# EAGLE design SENSE (EAGLE 9.6.2)
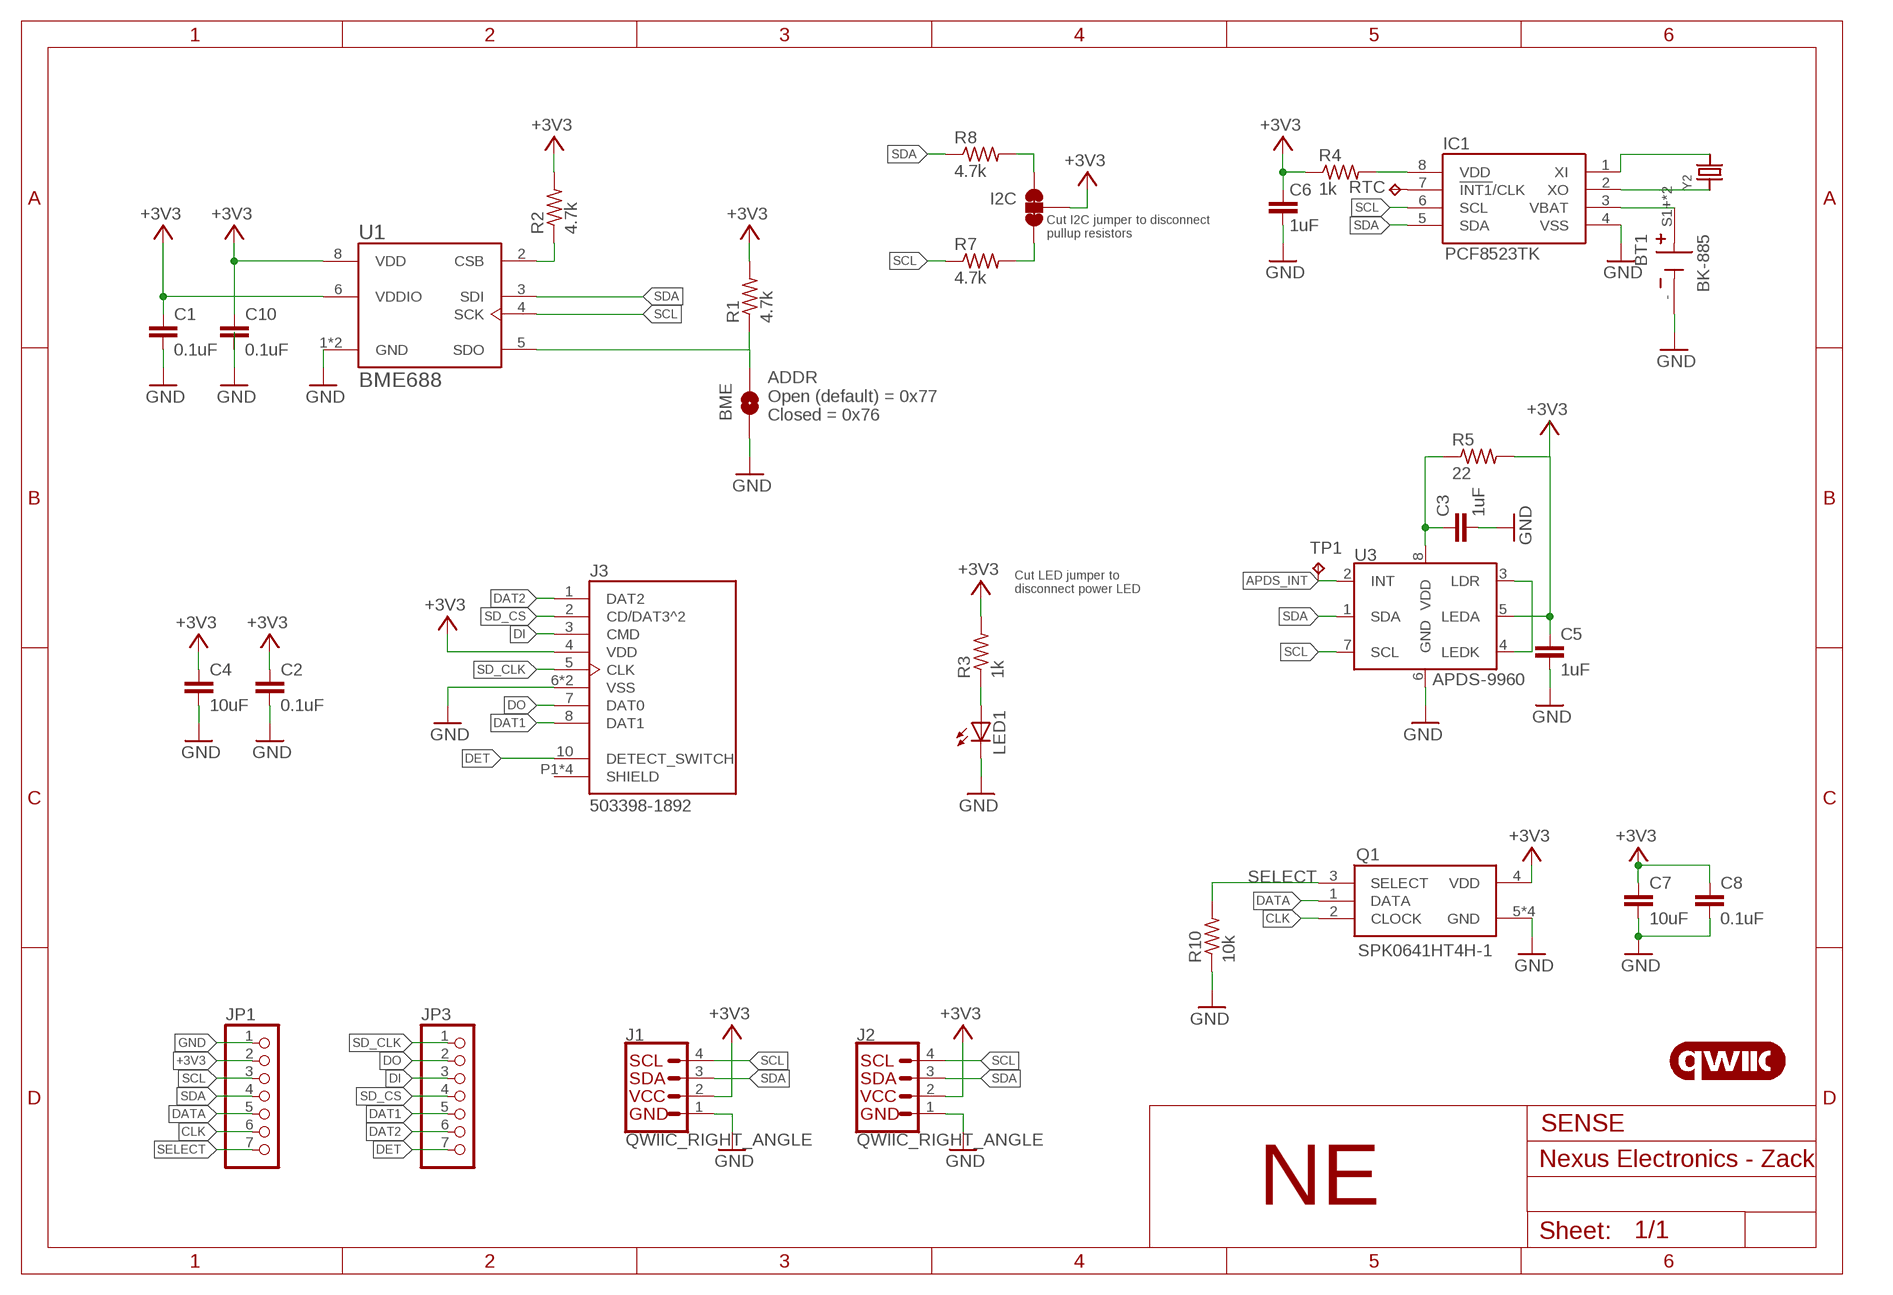
[diagram p0: schematic, sheet 1]

## Parts
BME  JUMPER-SMT_2_NO_SILK  [SMT-JUMPER_2_NO_SILK]
BT1  BK-885  [BAT_BK-885]
C1  0.1uF  C-0603  [0603-1608X90N]
C2  0.1uF  C-0603  [0603-1608X90N]
C3  1uF  C-0603  [0603-1608X90N]
C4  10uF  C-0603  [0603-1608X90N]
C5  1uF  C-0603  [0603-1608X90N]
C6  1uF  C-0603  [0603-1608X90N]
C7  10uF  C-0603  [0603-1608X90N]
C8  0.1uF  C-0603  [0603-1608X90N]
C10  0.1uF  C-0603  [0603-1608X90N]
I2C  JUMPER-SMT_3_2-NC_TRACE_SILK  [SMT-JUMPER_3_2-NC_TRACE_SILK]
IC1  PCF8523TK  PCF8523TK_1,118  [SON80P400X400X100-9N]
J1  QWIIC_RIGHT_ANGLE  QWIIC_CONNECTORJS-1MM  [JST04_1MM_RA]
J2  QWIIC_RIGHT_ANGLE  QWIIC_CONNECTORJS-1MM  [JST04_1MM_RA]
J3  503398-1892  [MOLEX_503398-1892]
JP1  MICROBUILDER_HEADER-1X12  [MICROBUILDER_1X12_ROUND]
JP3  MICROBUILDER_HEADER-1X12  [MICROBUILDER_1X12_ROUND]
LED1  LED_GREENCHIP-LED0603  [ADAFRUIT_CHIP-LED0603]
LOGO1  QWIIC_LOGO_CONNECTOR  [QWIIC_5.5MM]
Q1  SPK0641HT4H-1  [SPK0641HT4H1]
R1  4.7k  RCL_R-US_R0603  [0603-1608X90N]
R2  4.7k  RCL_R-US_R0603  [0603-1608X90N]
R3  1k  RCL_R-US_R0603  [0603-1608X90N]
R4  1k  RCL_R-US_R0603  [0603-1608X90N]
R5  22  RCL_R-US_R0603  [0603-1608X90N]
R7  4.7k  RCL_R-US_R0603  [0603-1608X90N]
R8  4.7k  RCL_R-US_R0603  [0603-1608X90N]
R10  10k  RCL_R-US_R0603  [0603-1608X90N]
RTC  TPB2,54  [B2,54]
TP1  TPB2,54  [B2,54]
U1  BME688  BME680  [PSON80P300X300X100-8N]
U3  APDS-9960  [APDS-9960]
Y2  MICROBUILDER_CRYSTAL_3215  [MICROBUILDER_XTAL3215]

## Nets
+3V3: C1.1 C2.1 C4.1 C5.1 C6.1 C7.1 C8.1 C10.1 I2C.2 J1.2 J2.2 J3.4(VDD) JP1.2 Q1.4(VDD) R1.2 R2.2 R3.2 R4.1 R5.2 U1.6(VDDIO) U1.8(VDD) U3.5(LEDA)
APDS_INT: TP1.TP U3.2(INT)
CLK: JP1.6 Q1.2(CLOCK)
CS: R2.1 U1.2(CSB)
DAT1: J3.8(DAT1) JP3.5
DAT2: J3.1(DAT2) JP3.6
DATA: JP1.5 Q1.1(DATA)
DET: J3.10(DETECT_SWITCH) JP3.7
DI: J3.3(CMD) JP3.3
DO: J3.7(DAT0) JP3.2
GND: BME.1 BT1.- C1.2 C2.2 C3.2 C4.2 C5.2 C6.2 C7.2 C8.2 C10.2 IC1.4(VSS) J1.1 J2.1 J3.6(VSS) J3.9(VSS) JP1.1 LED1.C Q1.5(GND) Q1.6(GND) Q1.7(GND) Q1.8(GND) R10.1 U1.1(GND) U1.7(GND) U3.6(GND)
N$1: C3.1 R5.1 U3.8(VDD)
N$2: IC1.2(XO) Y2.P$1
N$3: BT1.S1+(+) BT1.S2+(+) IC1.3(VBAT)
N$4: IC1.1(XI) Y2.P$2
N$5: LED1.A R3.1
N$6: IC1.7(!INT1!/CLK) RTC.TP
N$7: IC1.8(VDD) R4.2
N$8: I2C.1 R8.2
N$9: I2C.3 R7.2
N$10: U3.3(LDR) U3.4(LEDK)
SCL: IC1.6(SCL) J1.4 J2.4 JP1.3 R7.1 U1.4(SCK) U3.7(SCL)
SD_CLK: J3.5(CLK) JP3.1
SD_CS: J3.2(CD/DAT3^2) JP3.4
SDA: IC1.5(SDA) J1.3 J2.3 JP1.4 R8.1 U1.3(SDI) U3.1(SDA)
SDO/ADR: BME.2 R1.1 U1.5(SDO)
SELECT: JP1.7 Q1.3(SELECT) R10.2
Unconnected: J3.P1(SHIELD) J3.P2(SHIELD) J3.P3(SHIELD) J3.P4(SHIELD)

## Notes on the sheet
- Cut I2C jumper to disconnect
  pullup resistors
- ADDR
  Open (default) = 0x77
  Closed = 0x76
- Cut LED jumper to 
  disconnect power LED
- Nexus Electronics - Zack
- NE

## Library data of the parts
BME = SparkFun-Jumpers:JUMPER-SMT_2_NO: Normally open jumper This jumper has two pads in close proximity to each other. Apply solder to close the connection. Round pads are easier to solder for beginners, but are a lot larger. SparkFun Product that uses the round pads: SparkFun EL Sequencer <https://www.sparkfun.com/products/12781>
BT1 = BK-885:BK-885: BATTERY RETAINER COIN 12MM SMD Check availability <https://pricing.snapeda.com/parts/BK-885/MPD/view-part?ref=eda>; AVAILABILITY: In Stock; DESCRIPTION: BATTERY RETAINER COIN 12MM SMD; MF: MPD; MP: BK-885; PACKAGE: None; PRICE: None; PURCHASE-URL: https://pricing.snapeda.com/search/part/BK-885/?ref=eda
C1-C8 C10 = Arduino-rcl:C: SMD Capacitor
I2C = SparkFun-Jumpers:JUMPER-SMT_3_2-NC_TRACE: Normally closed trace jumper (2 of 2 connections) This jumper has a trace between all three pads so they are normally closed (NC). Use a razor knife to open the connection(s). For best results follow the IPC guidelines for cutting traces: Cutout at least 0.063 mm (0.005 in). Remove all loose material to clean up the cut area. Seal the cut with an approved epoxy. Reapply solder to reclose the connection(s).
IC1 = PCF8523:PCF8523TK_1,118: Real Time Clock Serial Clock/Calendar/Alarm/Timer/Battery Backup 8-Pin HVSON EP T/R Source: Datasheet <http://www.nxp.com/docs/en/data-sheet/PCF8523.pdf>; ARROW_PART_NUMBER: PCF8523TK/1,118; ARROW_PRICE-STOCK: https://www.arrow.com/en/products/pcf8523tk1118/nxp-semiconductors?region=nac; DESCRIPTION: Real Time Clock Serial Clock/Calendar/Alarm/Timer/Battery Backup 8-Pin HVSON EP T/R; HEIGHT: 1mm; MANUFACTURER_NAME: NXP; MANUFACTURER_PART_NUMBER: PCF8523TK/1,118; MOUSER_PART_NUMBER: 771-PCF8523TK/1118; MOUSER_PRICE-STOCK: https://www.mouser.co.uk/ProductDetail/NXP-Semiconductors/PCF8523TK-1118?qs=beN0Cyoe8Ym%252Bv1xGDkWHJQ%3D%3D
J1 J2 = SparkFun-Connectors:QWIIC_CONNECTOR: SparkFun I2C Standard Qwiic Connector An SMD 1mm pitch JST connector makes it easy and quick (get it? Qwiic?) to connect I2C devices to each other. The Qwiic system <http://www.sparkfun.com/qwiic> enables fast and solderless connection between popular platforms and various sensors and actuators. We carry 200mm <https://www.sparkfun.com/products/14204>, 100mm <https://www.sparkfun.com/products/14205>, 50mm <https://www.sparkfun.com/products/14206>, and breadboard friendly <https://www.sparkfun.com/products/14207> Qwiic cables. We also offer 10 pcs strips <https://www.sparkfun.com/products/14323> the SMD connectors.; PROD_ID: CONN-13694
J3 = 503398-1892:503398-1892: 1.10mm Pitch microSD Memory Card Connector, Normal Mount Surface Mount, Push-Push Type, 1.28mm Height Check prices <https://pricing.snapeda.com/parts/503398-1892/Molex%2C%20LLC/view-part?ref=eda>; AVAILABILITY: In Stock; DESCRIPTION: 9 (8 + 1) Position Card Connector Secure Digital - microSD™ Surface Mount, Right Angle Gold; MF: Molex, LLC; MP: 503398-1892; PACKAGE: None; PRICE: None; PURCHASE-URL: https://pricing.snapeda.com/search/part/503398-1892/?ref=eda
JP1 JP3 = Pin Header:MICROBUILDER_HEADER-1X12
LED1 = Nexus IOT Development Board Rev A:LED_GREEN: LED OSRAM: - CHIPLED LG R971, LG N971, LY N971, LG Q971, LY Q971, LO R971, LY R971 LH N974, LH R974 LS Q976, LO Q976, LY Q976 LO Q996 - Hyper CHIPLED LW Q18S LB Q993, LB Q99A, LB R99A - SideLED LS A670, LO A670, LY A670, LG A670, LP A670 LB A673, LV A673, LT A673, LW A673 LH A674 LY A675 LS A676, LA A676, LO A676, LY A676, LW A676 LS A679, LY A679, LG A679 - Hyper Micro SIDELED® LS Y876, LA Y876, LO Y876, LY Y876 LT Y87S - SmartLED LW L88C, LW L88S LB L89C, LB L89S, LG L890 LS L89K, LO L89K, LY L89K LS L896, LA L896, LO L896, LY L896 - TOPLED LS T670, LO T670, LY T670, LG T670, LP T670 LSG T670, LSP T670, LSY T670, LOP T670, LYG T670 LG T671, LOG T671, LSG T671 LB T673, LV T673, LT T673, LW T673 LH T674 LS T676, LA T676, LO T676, LY T676, LB T676, LH T676, LSB T676, LW T676 LB T67C, LV T67C, LT T67C, LS T67K, LO T67K, LY T67K, LW E67C LS E67B, LA E67B, LO E67B, LY E67B, LB E67C, LV E67C, LT E67C LW T67C LS T679, LY T679, LG T679 LS T770, LO T770, LY T770, LG T770, LP T770 LB T773, LV T773, LT T773, LW T773 LH T774 LS E675, LA E675, LY E675, LS T675 LS T776, LA T776, LO T776, LY T776, LB T776 LHGB T686 LT T68C, LB T68C - Hyper Mini TOPLED® LB M676 - Mini TOPLED Santana® LG M470 LS M47K, LO M47K, LY M47K Source: http://www.osram.convergy.de/
LOGO1 = SparkFun-Aesthetics:QWIIC_LOGO: Qwiic Logos for placement on schematic and PCB. The 5.5mm silk logo is best for placing next to Qwiic connector.
Q1 = SPK0641HT4H-1:SPK0641HT4H-1: MEMS Microphones Source: Datasheet <https://componentsearchengine.com/Datasheets/1/SPK0641HT4H-1.pdf>; DESCRIPTION: MEMS Microphones; HEIGHT: 1.1mm; MANUFACTURER_NAME: Knowles Johanson Manufacturing; MANUFACTURER_PART_NUMBER: SPK0641HT4H-1; MOUSER_PART_NUMBER: 721-SPK0641HT4H-1; MOUSER_PRICE-STOCK: https://www.mouser.com/Search/Refine.aspx?Keyword=721-SPK0641HT4H-1
R1-R5 R7 R8 R10 = Nexus IOT Development Board Rev A:RCL_R-US_: RESISTOR, American symbol; SPICEPREFIX: R
RTC TP1 = testpad:TP: Test pad
U1 = BME680:BME680: Integrated Environmental Unit Check prices <https://pricing.snapeda.com/parts/BME680/Bosch%20Sensortec/view-part?ref=eda>; AVAILABILITY: In Stock; DESCRIPTION: Gas, Humidity, Pressure, Temperature Sensor I²C, SPI Output; MF: Bosch Sensortec; MP: BME680; PACKAGE: LGA-8 Bosch Tools; PRICE: None
U3 = APDS-9960:APDS-9960: Avago APDS-9960 Digital Proximity, Ambient Light, RGB, and Gesture Sensor. The APDS-9960 offers ambient light and color measuring, proximity detection, and touchless gesture sensing. It features UV and IR blocking filters, four separate diodes sensitive to different directions, and an I2C compatible interface. Datasheet <https://cdn.sparkfun.com/datasheets/Sensors/Proximity/apds9960.pdf> SparkFun Products SparkFun RGB and Gesture Sensor - APDS-9960 <https://www.sparkfun.com/products/12787> (SEN-12787) Check prices <https://pricing.snapeda.com/parts/APDS-9960/Broadcom%20/%20Avago/view-part?ref=eda>; AVAILABILITY: In Stock; DESCRIPTION: Optical Sensor Ambient 560nm I²C 8-SMD Module; MF: Broadcom / Avago; MP: APDS-9960; PACKAGE: SMD-8 Broadcom / Avago; PRICE: None; PURCHASE-URL: https://pricing.snapeda.com/search/part/APDS-9960/?ref=eda
Y2 = Adafrruit:MICROBUILDER_CRYSTAL: Crystals HC49UP - Surface Mount Crystal 4.0MHz 18pF +/-30ppm Surface Mount Crystal [Digikey: 535-9857-1-ND] 12.0 MHz Surface Mount Crystal [Digikey: 535-9869-6-ND] 25.0 MHz Surface Mount Crystal [Digikey: 535-9078-1-ND] 2.5 x 2.0mm - MEMs SMT Crystal 16.0 MHz 10pF 20ppm 2.5 x 2.0mm Crystal [Digikey -40-85°C: 535-10923-1-ND] 3.2 x 2.5mm - MEMs SMT Crystal 12.0 MHz 8pF 15ppm 3.2 x 2.5mm Crystal [Digikey: -10-70°C: 644-1047-1-ND -40-125°C: 644-1128-1-ND] 40~85°C cheaper: 644-1173-6-ND 16.0 MHz 8pF 15ppm 3.2 x 2.5mm Crystal [Digikey: -10-70°C: 644-1049-1-ND -40-125°C: 644-1129-2-ND]-40~85°C cheaper: 644-1175-6-ND 16.0 MHz 10pF 10ppm 3.2 x 2.5mm Crystal [Digikey: 644-1100-1-ND] 27.12 MHz 18pF 30ppm 3.2 x 2.5mm Crystal [Digikey: 887-1424-1-ND] 27.12MHz 10pF 10ppm 3.2 x 2.5mm Crystal [Digikey: 887-1329-1-ND] 4.9 x 1.8mm - MEMs SMT Crystal 32.768 KHz 12.5pF 20ppm 4.9 x 1.8mm Crystal [Digikey: SE2415CT-ND] 8.0 x 3.8mm - Surface Mount Crystal 32.768kHz 12.5pF 20ppm -40°C-85°C [Digikey: 535-9166-2-ND] Cylinder 32.768KHz Cylinder Crystal (2x6mm body) [Ex. Digikey: 300-8341-2-ND]

## Board
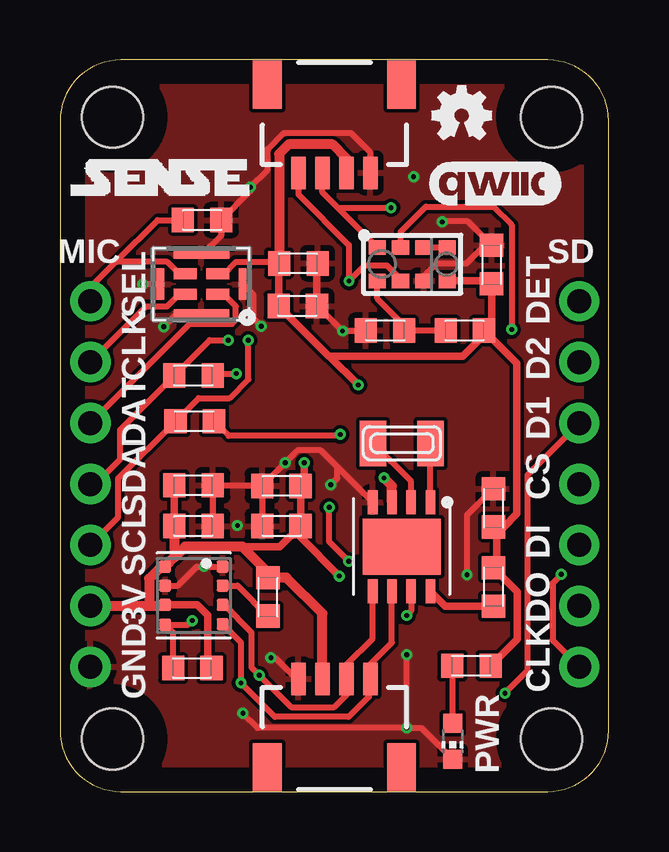
[diagram p1: board, top side]
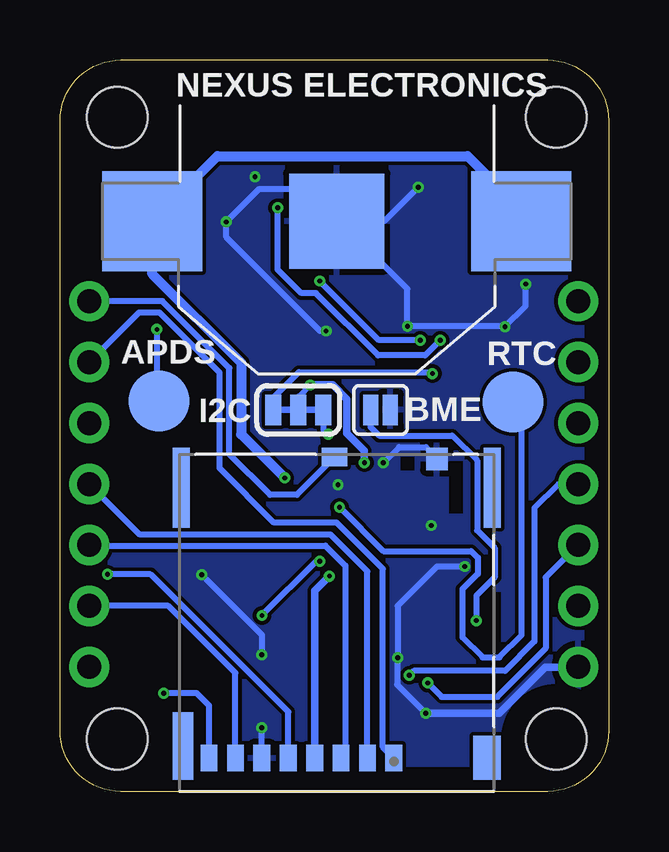
[diagram p2: board, bottom side, seen from below]

Size 22.86 x 30.48 mm. Coordinates in mm from the lower left corner, seen from the top.
Outline: 20.32,30.48 2.54,30.48 arc90 0,27.94 0,2.54 arc90 2.54,0 20.32,0 arc90 22.86,2.54 22.86,27.94 arc90 20.32,30.48
Copper layers (1*16): Top 0.035mm / dielectric 1.5mm / Bottom 0.035mm
Design rules "default *": minimum track width 6mil, minimum drill 0.35mm, track to track 6mil, track to pad 6mil, pad to pad 6mil, via to via 6mil, smd to smd 6mil, copper to edge 40mil, drill to drill 6mil, minimum pad ring 10mil, minimum via ring 5mil, stop-mask expansion 4mil, vias tented up to drill 13mil, thermal gap 10mil
Holes 2.54 mm at 2.18,28.09 20.47,28.09 2.18,2.18 20.47,2.18

### Footprints (pad centres in the part's own frame; a part is rotated, then mirrored left to right if it is on the bottom)
SMT-JUMPER_2_NO_SILK = smd 0.635 x 1.27: 1 -0.406,0; 2 0.406,0
BAT_BK-885 = smd 3.96 x 3.96: - 0,0 | smd 4.17 x 4.17: S1+ -7.685,0; S2+ 7.685,0
0603-1608X90N = smd 0.95 x 1: 1 -0.8,0; 2 0.8,0
SMT-JUMPER_3_2-NC_TRACE_SILK = smd 0.66 x 1.27: 1 -1.041,0; 2 0,0; 3 1.041,0
SON80P400X400X100-9N = smd 1 x 0.4: 1 -1.85,1.2; 2 -1.85,0.4; 3 -1.85,-0.4; 4 -1.85,-1.2; 5 1.85,-1.2; 6 1.85,-0.4; 7 1.85,0.4; 8 1.85,1.2 | smd 2.35 x 3.25: 9 0,0
JST04_1MM_RA = smd 0.6 x 1.35: 1 -1.5,0; 2 -0.5,0; 3 0.5,0; 4 1.5,0 | smd 1.2 x 2: NC1 2.8,-3.675; NC2 -2.8,-3.675
MOLEX_503398-1892 = smd 0.7 x 1.1: 1 -2.38,5.625; 2 -1.28,5.625; 3 -0.18,5.625; 4 0.92,5.625; 5 2.02,5.625; 6 3.12,5.625; 7 4.22,5.625; 8 5.32,5.625 | smd 0.9 x 0.93: 9 -4.17,-6.84 | smd 1.05 x 0.78: 10 0.095,-6.915 | smd 1.14 x 1.83: P1 -6.26,5.61 | smd 0.86 x 2.8: P2 6.4,5.125 | smd 0.7 x 3.33: P3 -6.48,-5.64; P4 6.48,-5.64
MICROBUILDER_1X12_ROUND = drill 1 pad 1.676: 1 -8.89,0; 2 -6.35,0; 3 -3.81,0; 4 -1.27,0; 5 1.27,0; 6 3.81,0; 7 6.35,0
ADAFRUIT_CHIP-LED0603 = smd 0.8 x 0.8: A 0,-0.75; C 0,0.75
SPK0641HT4H1 = smd 0.45 x 0.95: 1 -0.425,-0.675; 2 -0.425,0.675; 3 0.425,0.675; 4 0.425,-0.675 | smd 1.3 x 0.325: 5 0,-1.712; 7 0,1.712 | smd 0.325 x 2.3: 6 -1.212,0; 8 1.212,0
B2,54 = smd 2.54 x 2.54: TP 0,0
PSON80P300X300X100-8N = smd 0.5 x 0.5: 1 1.2,1.2; 2 1.2,0.4; 3 1.2,-0.4; 4 1.2,-1.2; 5 -1.2,-1.22; 6 -1.2,-0.4; 7 -1.2,0.4; 8 -1.2,1.2
APDS-9960 = smd 0.6 x 0.72: 1 0.7,1.455; 2 0.7,0.485; 3 0.7,-0.485; 4 0.7,-1.455; 5 -0.7,-1.455; 6 -0.7,-0.485; 7 -0.7,0.485; 8 -0.7,1.455
MICROBUILDER_XTAL3215 = smd 1.1 x 1.9: P$1 1.2,0; P$2 -1.2,0

### Placement (x,y rotation side)
BME  9.51,15.9 180 bottom
BT1  11.33,23.76 0 bottom
C1  5.56,12.76 0 top
C2  9.22,11.06 180 top
C3  13.54,19.21 180 top
C4  9.22,12.74 180 top
C5  17.98,21.96 90 top
C6  18.06,11.82 90 top
C7  9.93,22.01 0 top
C8  9.91,20.23 0 top
C10  5.56,11.06 0 top
I2C  12.93,15.9 0 bottom
IC1  14.23,10.2 270 top
J1  11.43,4.69 0 top
J2  11.43,25.78 180 top
J3  11.33,7.02 180 bottom
JP1  1.27,14.08 90 top
JP3  21.64,14.08 90 top
LED1  16.36,2.09 180 top
LOGO1  18.14,25.33 0 top
Q1  5.89,21.14 90 top
R1  5.51,5.14 0 top
R2  8.66,8.11 90 top
R3  17.15,5.24 0 top
R4  18.06,8.52 270 top
R5  16.87,19.21 0 top
R7  5.61,15.43 0 top
R8  5.56,17.33 0 top
R10  5.92,23.81 180 top
RTC  3.99,16.24 270 bottom
TP1  18.74,16.28 0 bottom
U1  5.58,8.17 0 top
U3  14.68,21.97 90 top
U$2  [OSHW-LOGO-MINI]  16.74,28.18 0 top
Y2  14.24,14.51 180 top

### Tracks (layer width: path | path; a pad name or v marks a point on that pad's centre or on a via)
+3V3  (via drill 0.2)
  Top 0.254: U1.6 4.15,7.77 | Q1.4 6.6,21.54 6.79,21.54 7.33,22.07 9.07,22.07 C7.1 | R5.2 17.62,19.17 17.81,19.17 | 10.93,6.86 10.93,7.42 | 11.23,18.15 11.19,18.15
  Top 0.305: U1.6 5.72,7.77 6.16,7.34 6.16,5.29 R1.2 | 18.21,9.17 R4.1 17.93,9.19 | 18.21,9.17 19.05,8.33 19.05,6.35 R3.2 | R5.2 19.03,17.85 19.03,11.57 18.48,11.02 C6.1 18.21,10.88 18.21,9.17 | C10.1 C1.1 | U3.5 17.87,21.27 C5.1 17.98,19.34 17.81,19.17 16.79,18.15 11.23,18.15 v12.43,16.94 | 11.19,18.15 C8.1 9.11,21.98 C7.1 | C2.1 C4.1 10.18,12.89 v10.18,13.7 | C2.1 9.17,10.2 7.6,10.2 | v11.63,8.98 10.02,10.59 C2.1
  Top 0.406: 10.97,4.25 10.97,4.65 J1.2 10.93,7.42 9.44,8.91 8.89,8.91 | J2.2 11.93,26.38 11.35,26.96 9.53,26.96 9.13,26.57 C7.1 | JP1.2 3.71,7.73 | 3.71,7.73 4.34,7.73 U1.6 | 8.89,8.91 R2.2 | R2.2 8.52,9.05 | R2.2 8.42,9.15 | 4.76,9.76 5.21,10.2 7.6,10.2 8.89,8.91 | C10.1 4.76,9.76 | 4.76,9.76 U1.8 4.21,9.37 3.71,8.87 3.71,7.73
  Bottom 0.254: I2C.2 12.93,16.21 12.92,16.22 12.92,16.45 v12.43,16.94 | v12.43,16.94
  Bottom 0.305: v11.63,8.98 12.25,8.36 J3.4 | v12.43,16.94 11.49,16.94 10.9,16.35 10.9,14.92 10.18,14.19 v10.18,13.7
APDS_INT  (via drill 0.2)
  Top 0.254: U3.2 14.19,23.32 15.24,24.37 18.06,24.37 18.82,23.61 v18.82,19.25
  Bottom 0.254: v18.82,19.25 18.82,16.36 TP1.TP
CLK
  Top 0.254: 4.98,20.72 4.99,20.72 Q1.2 4.96,20.72 4.46,20.21 3.59,20.21 JP1.6
CS
  Top 0.254: U1.2 7.4,8.57 R2.1
DAT1  (via drill 0.2)
  Top 0.254: v18.54,4.1 18.54,4.12 19.48,5.06 19.48,13.19 JP3.5
  Bottom 0.254: J3.8 16.65,3.58 17.17,4.1 v18.54,4.1
DAT2
  Bottom 0.254: J3.1 9.41,1.85 9.41,9.28 11.33,11.21 13.94,11.21 16.21,13.47 16.21,17.45 18.71,19.95 19.58,19.95 JP3.6
DATA
  Top 0.254: 6.78,20.75 6.6,20.75 6.58,20.73 | Q1.1 6.58,20.73 | JP1.5 5.41,19.49 7.16,19.49 7.32,19.65 7.32,20.21 6.8,20.73 6.58,20.73
DET
  Bottom 0.254: JP3.7 18.59,20.43 15.8,17.64 15.8,14.06 14.11,12.36 12.99,12.36 J3.10
DI
  Bottom 0.254: J3.3 10.97,1.57 10.97,9.41 11.8,10.25 21.62,10.25 JP3.3
DO
  Bottom 0.254: J3.7 15.55,4.94 18.34,7.73 JP3.2
GND  (via drill 0.2)
  Top 0.254: U3.6 15.16,21.47 15.7,22.01 16.94,22.01 17.69,22.76 C5.2 16.98,23.76 15.95,23.76 v15.93,23.73 | Q1.8 6.72,23.18 R10.1 7.93,25.02 v7.93,25.18 8.65,25.89 8.65,26.77 9.33,27.44 12.12,27.44 12.93,26.63 J2.1 | C8.2 10.73,20.23 v11.77,19.19 12.71,19.19 C3.2 | v14.45,2.65 15.05,2.65 LED1.C | C10.2 C1.2 8.45,12.76 | C4.2 C2.2 | C4.2 8.45,12.76 | 8.45,12.76 v9.39,13.7 | U1.1 v6,9.37 5.71,9.37 4.91,8.57 U1.7 | Q1.5 8.05,20.7 8.05,19.72 v8.38,19.39 | Q1.6 4.88,19.93 v4.32,19.36 | Q1.7 v3.46,21.14 | C4.2 v9.39,13.7 | v14.45,2.65 v14.45,5.7 | C6.2 16.96,11.52 v16.96,9.03 | J1.1 9.85,4.69 8.97,5.57 v8.79,5.57 | v14.45,2.65 8.23,2.65 v7.62,3.26 | v9.39,13.7 9.9,14.22 10.86,14.22 11.55,13.53 | 11.55,13.53 IC1.4 | v11.28,12.79 11.55,13.06 11.55,13.53
  Top 0.305: C8.2 10.71,21.98 C7.2
  Bottom 0.254: J3.6 v14.45,2.65 | v16.96,9.03 14.45,6.53 v14.45,5.7 | v7.62,3.26 8.81,4.45 8.81,5.55 v8.79,5.57 8.79,7.74 7.15,9.37 v6,9.37 | v3.46,21.14 3.46,20.23 v4.32,19.36 4.34,19.39 v8.38,19.39 8.38,20.95 11.2,23.76 | v7.93,25.18 9.34,23.76 11.2,23.76 | 11.2,23.76 BT1.- 12.67,25.11 14.55,25.11 v15.93,23.73 15.93,23.1 12.02,19.19 v11.77,19.19 | J3.9 7.14,13.88 7.61,14.35 8.73,14.35 v9.39,13.7
  Bottom 0.305: JP1.1 1.28,5.18 2.64,5.18 4.56,3.26 v7.62,3.26
  other vias: 7.39,11.08 14.73,25.61
  pour Top: 1.36,31.07 -0.74,28.98 -0.74,1.36 1.19,-0.57 21.79,-0.57 23.98,1.61 23.98,29.12 22.02,31.07
  pour Bottom: 0.7,31.63 -1.59,29.34 -1.59,1.06 0.85,-1.38 21.76,-1.38 24.5,1.36 24.5,2.85 24.5,29.59 22.4,31.69 0.76,31.69
N$1
  Top 0.254: U3.8 13.22,20.53 14.34,19.42 C3.1 R5.1
N$2
  Top 0.254: IC1.2 14.63,12.92 Y2.P$1
N$3  (via drill 0.2)
  Top 0.406: IC1.3 13.83,12.73 v13.5,13.07
  Bottom 0.406: BT1.S2+ 3.58,23.7 3.1,23.7 5.88,26.48 16.3,26.48 BT1.S1+ 19.01,21.56 15.32,17.87 15.32,14.88 v13.5,13.07
N$4
  Top 0.254: IC1.1 Y2.P$2
N$5
  Top 0.254: 16.35,2.85 LED1.A 16.35,2.86 R3.1
N$6  (via drill 0.2)
  Top 0.254: IC1.7 14.63,7.52 v14.44,7.34 | v12.04,9.59 11.21,10.41 v11.21,11.85
  Bottom 0.254: v14.44,7.34 12.19,9.59 v12.04,9.59 | v11.21,11.85 9.38,10.02 5.73,10.02 5.45,9.74 5.45,9.07 6.09,8.43 6.09,6.43 5.25,5.59 4.55,5.59 3.62,6.51 3.62,15.87 RTC.TP
N$7
  Top 0.305: IC1.8 16.06,7.72 R4.2
N$8  (via drill 0.2)
  Top 0.254: R8.2 6.44,17.41 v7.34,17.41
  Bottom 0.254: 13.76,15.9 I2C.1 13.92,15.95 13.92,16.45 12.9,17.48 7.4,17.48 v7.34,17.41
N$9  (via drill 0.2)
  Top 0.254: v11.68,14.88 11.62,14.82 7.02,14.82 R7.2
  Bottom 0.254: I2C.3 11.89,15.09 v11.68,14.88
N$10
  Top 0.254: U3.3 U3.4
SCL  (via drill 0.2)
  Top 0.254: U3.7 14.12,21.35 14.12,21.43 13.64,21.91 12.68,21.91 v12.04,21.27 12.04,22.77 9.93,24.88 J2.4 | U1.4 7.54,6.21 v7.54,4.53 8.96,3.11 12.03,3.11 12.86,3.94 12.86,4.62 J1.4 12.93,5.3 13.83,6.2 IC1.6 | JP1.3 2.41,11.42 2.41,13.03 R7.1 5.78,16.39 7.07,16.39 7.85,17.17 v7.85,18.8 v7.85,18.81
  Bottom 0.254: JP1.3 2.62,8.92 2.62,5.96 4.64,3.95 6.96,3.95 v7.54,4.53 | v7.85,18.81 9.58,18.81 v12.04,21.27
SD_CLK  (via drill 0.2)
  Top 0.254: v20.88,9.05 20.88,9.03 20.52,8.68 20.52,6.31 JP3.1
  Bottom 0.254: J3.5 13.35,3.31 19.09,9.05 v20.88,9.05
SD_CS
  Bottom 0.254: J3.2 10.05,9.17 11.58,10.7 19.53,10.7 JP3.4
SDA  (via drill 0.2)
  Top 0.254: U3.1 11.58,24.31 | 11.58,24.31 10.93,24.96 J2.3 | 6.88,7.73 6.85,7.73 6.8,7.77 U1.3 6.84,7.77 7.98,6.64 7.98,5.17 v8.31,4.84 9.63,3.52 11.43,3.52 11.93,4.01 J1.3 11.93,5.27 13.03,6.37 IC1.5 | JP1.4 1.47,12.81 2.49,13.83 2.49,15.06 R8.1 6.24,18.81 v7.01,18.81 | 11.58,24.31 v13.79,24.31 v13.79,24.32
  Bottom 0.254: JP1.4 2.08,12.81 3.09,11.81 3.09,6.25 4.31,5.03 8.12,5.03 v8.31,4.84 | v13.79,24.32 v13.8,24.31 13.8,21.76 12.8,20.76 12.19,20.76 9.6,18.17 7.65,18.17 v7.01,18.81
SDO/ADR  (via drill 0.2)
  Top 0.254: U1.5 4.71,6.62 R1.1 4.71,5.08 | U1.5 4.36,6.97 | U1.5 5.34,6.95 v5.51,7.12
  Bottom 0.254: BME.2 9.92,15.18 9.57,14.83 6.52,14.83 5.48,13.79 5.48,10.88 4.75,10.15 4.75,8.92 5.51,8.17 v5.51,7.13 v5.51,7.12
SELECT
  Top 0.254: 5.03,21.51 5.16,21.51 Q1.3 4.96,21.57 4.46,22.07 2.37,22.07 2.35,22.09 | JP1.7 1.27,21.01 2.35,22.09 | R10.2 4.07,23.81 2.35,22.09

### Text on the board
tNames: MIC | SD | SEL | DET | CLK | D2 | DAT | D1 | CS | SDA | DI | SCL | 3V | DO | CLK | GND | PWR
bNames: NEXUS ELECTRONICS | RTC | APDS